# Altium project PCB_Project.PrjPcb
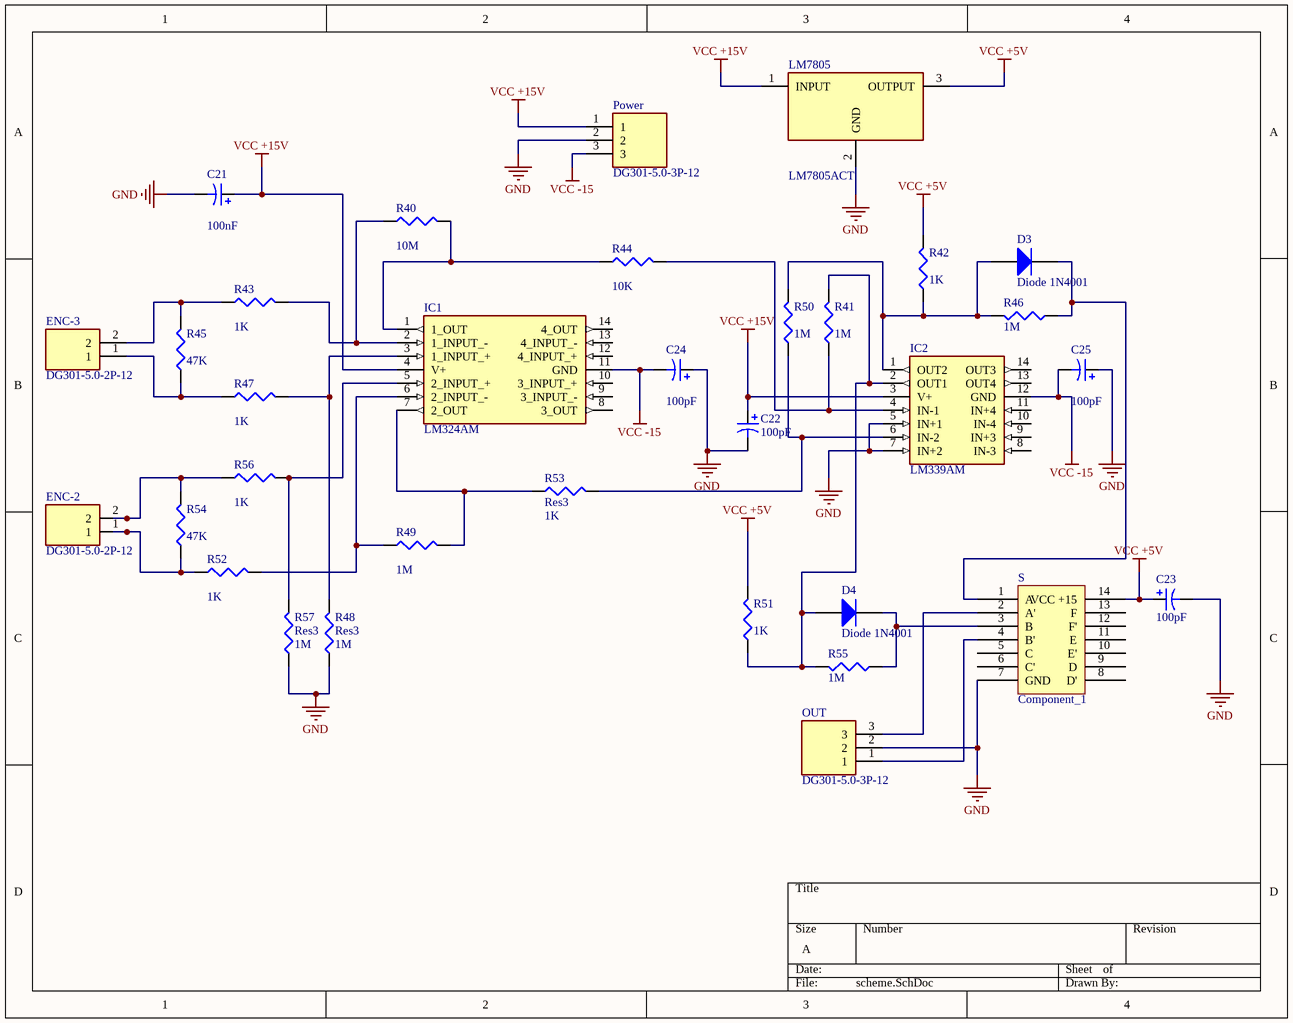
[diagram p0: scheme.SchDoc]
1 sheet, 33 parts. Net scope: global (net labels, ports and power ports of the same name join across sheets).
Board file: pcb.PcbDoc

## Sheet scheme.SchDoc
size A

### Parts
C21  value 100nF  [C1206]  (hidden comment: Cap Pol3)
C22  value 100pF  [C1206]  (hidden comment: Cap Pol3)
C23  value 100pF  [C1206]  (hidden comment: Cap Pol3)
C24  value 100pF  [C1206]  (hidden comment: Cap Pol3)
C25  value 100pF  [C1206]  (hidden comment: Cap Pol3)
D3  Diode 1N4001  [SOT23_N]
D4  Diode 1N4001  [SOT23_N]
ENC-2  DG301-5.0-2P-12  [SHDR2W110P0X500_1X2_1000X760X1000P]
ENC-3  DG301-5.0-2P-12  [SHDR2W110P0X500_1X2_1000X760X1000P]
IC1  LM324AM  [SOIC127P600X175-14N]
IC2  LM339AM  [SOIC127P600X175-14N]
LM7805  LM7805ACT  [TO254P470X1016X2019-3P]
OUT  DG301-5.0-3P-12  [SHDR3W110P0X500_1X3_1500X760X1000P]
Power  DG301-5.0-3P-12  [SHDR3W110P0X500_1X3_1500X760X1000P]
R40  value 10M  [C1206]  (hidden comment: Res3)
R41  value 1M  [C1206]  (hidden comment: Res3)
R42  value 1K  [C1206]  (hidden comment: Res3)
R43  value 1K  [C1206]  (hidden comment: Res3)
R44  value 10K  [C1206]  (hidden comment: Res3)
R45  value 47K  [C1206]  (hidden comment: Res3)
R46  value 1M  [C1206]  (hidden comment: Res3)
R47  value 1K  [C1206]  (hidden comment: Res3)
R48  Res3  value 1M  [C1206]
R49  value 1M  [C1206]  (hidden comment: Res3)
R50  value 1M  [C1206]  (hidden comment: Res3)
R51  value 1K  [C1206]  (hidden comment: Res3)
R52  value 1K  [C1206]  (hidden comment: Res3)
R53  Res3  value 1K  [C1206]
R54  value 47K  [C1206]  (hidden comment: Res3)
R55  value 1M  [C1206]  (hidden comment: Res3)
R56  value 1K  [C1206]  (hidden comment: Res3)
R57  Res3  value 1M  [C1206]
S  Component_1  [SOIC127P600X175-14N]

### Nets
GND: C21.2 C22.2 C23.2 C24.1 C25.1 IC2.5(IN+1) IC2.7(IN+2) LM7805.2(GND) OUT.2 Power.2 R48.1 R57.1 S.7(GND)
VCC +5V: C23.1 LM7805.3(OUTPUT) R42.2 R51.2 S.14(VCC_+15)
VCC +15V: C21.1 C22.1 IC1.4(V+) IC2.3(V+) LM7805.1(INPUT) Power.1
VCC -15: C24.2 C25.2 IC1.11(GND) IC2.12(GND) Power.3
NetD3_1: D3.1(A) IC2.1(OUT2) R42.1 R46.2 R50.2
NetD3_2: D3.2(K) R46.1 S.1(A)
NetD4_1: D4.1(A) IC2.2(OUT1) R41.2 R51.1 R55.2
NetD4_2: D4.2(K) R55.1 S.3(B)
NetENC-2_1: ENC-2.1 R52.1 R54.1
NetENC-2_2: ENC-2.2 R54.2 R56.1
NetENC-3_1: ENC-3.1 R45.1 R47.1
NetENC-3_2: ENC-3.2 R43.1 R45.2
NetIC1_1: IC1.1(1_OUT) R40.2 R44.1
NetIC1_2: IC1.2(1_INPUT_-) R40.1 R43.2
NetIC1_3: IC1.3(1_INPUT_+) R47.2 R48.2
NetIC1_5: IC1.5(2_INPUT_+) R56.2 R57.2
NetIC1_6: IC1.6(2_INPUT_-) R49.1 R52.2
NetIC1_7: IC1.7(2_OUT) R49.2 R53.1
NetIC2_4: IC2.4(IN-1) R41.1 R44.2
NetIC2_6: IC2.6(IN-2) R50.1 R53.2
NetOUT_1: OUT.1 S.4(B')
NetOUT_3: OUT.3 S.2(A')

Not connected (* = marked no-connect by the designer): IC1 8(3_OUT) 9(3_INPUT_-) 10(3_INPUT_+) 12(4_INPUT_+) 13(4_INPUT_-) 14(4_OUT); IC2 8(IN-3) 9(IN+3) 10(IN-4) 11(IN+4) 13(OUT4) 14(OUT3); S 5(C) 6(C') 8(D') 9(D) 10(E') 11(E) 12(F') 13(F)

### Library data of the parts
C21-C25 = Cap Pol3: Polarized Capacitor (Surface Mount); Published: 8-Jun-2000; LatestRevisionDate: 29-May-2009; LatestRevisionNote: IPC-7351 Footprint Added.; PackageReference: C0805; Publisher: Altium Limited; PackageDescription: Chip Capacitor
D3 D4 = Diode 1N4001: 1 Amp General Purpose Rectifier; Published: 8-Jun-2000; LatestRevisionDate: 17-Jul-2002; LatestRevisionNote: Re-released for DXP Platform.; DatasheetVersion: 1998; PackageVersion: Aug-1999; PackageReference: DO-41; Publisher: Altium Limited; PackageDescription: Diode, Axial; Body 5.2 x 2.7 mm (LxDia. max), Lead Dia. 0.86 mm (max); Code_JEDEC: DO-204-AL; ComponentLink1Description: Manufacturer Link; ComponentLink1URL: http://www.fairchildsemi.com/; ComponentLink2Description: Datasheet; ComponentLink2URL: http://www.fairchildsemi.com/ds/1N%2F1N4001.pdf
ENC-2 ENC-3 = DG301-5.0-2P-12: Connector; Manufacturer_Name: Degson; Datasheet Link: https://www.tme.eu/gb/Document/72ad9f371bb0c16572574ac47903b3a1/DG301-5.0.pdf; Height: 10mm; Manufacturer_Part_Number: DG301-5.0-2P-12
IC1 = LM324AM: Integrated Circuit; Manufacturer_Name: Texas Instruments; Datasheet Link: http://www.ti.com/lit/ds/symlink/lm324-n.pdf; Height: 1.75mm; Manufacturer_Part_Number: LM324AM; Mouser Part Number: 926-LM324AM; Mouser Price/Stock: https://www.mouser.com/Search/Refine.aspx?Keyword=926-LM324AM; RS Part Number: 4713839
IC2 = LM339AM: Integrated Circuit; Manufacturer_Name: Texas Instruments; Datasheet Link: http://www.ti.com/lit/ds/symlink/lm339-n.pdf; Height: 1.75mm; Manufacturer_Part_Number: LM339AM; Mouser Part Number: 926-LM339AM; Mouser Price/Stock: https://www.mouser.com/Search/Refine.aspx?Keyword=926-LM339AM; RS Part Number: 6364697
LM7805 = LM7805ACT: Integrated Circuit; Manufacturer_Name: Fairchild Semiconductor; Datasheet Link: http://www.farnell.com/datasheets/1936075.pdf; Height: 4.7mm; Manufacturer_Part_Number: LM7805ACT; Mouser Part Number: 512-LM7805ACT; Mouser Price/Stock: https://www.mouser.com/Search/Refine.aspx?Keyword=512-LM7805ACT; RS Part Number: 8062839; RS Price/Stock: http://uk.rs-online.com/web/p/products/8062839
OUT Power = DG301-5.0-3P-12: Connector; Manufacturer_Name: Degson; Datasheet Link: https://www.tme.eu/gb/Document/72ad9f371bb0c16572574ac47903b3a1/DG301-5.0.pdf; Height: 10mm; Manufacturer_Part_Number: DG301-5.0-3P-12
R40-R57 = Res3: Resistor; Published: 8-Jun-2000; LatestRevisionDate: 29-May-2009; LatestRevisionNote: IPC-7351 Footprint Added.; PackageReference: J1-0603; Publisher: Altium Limited; PackageDescription: Chip Resistor